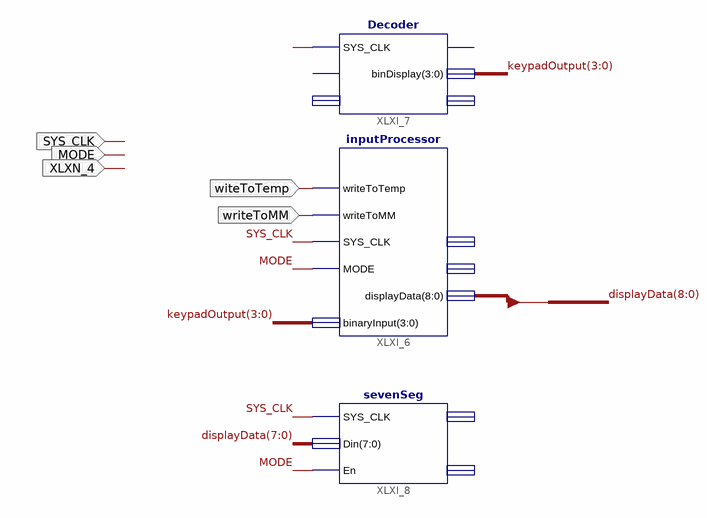
[diagram p0: schematic sheet 1]
// Xilinx ISE schematic RyanSandbox.sch (spartan3e) as structural Verilog: 3 symbols, 5 ports
module RyanSandbox (
  input  SYS_CLK,
  input  MODE,
  input  XLXN_4,
  input  writeToMM,
  input  witeToTemp
);

  wire XLXN_2;
  wire [3:0] keypadOutput;
  wire [8:0] displayData;

  inputProcessor XLXI_6 (
    .SYS_CLK(SYS_CLK), .writeToTemp(witeToTemp), .binaryInput(keypadOutput), .writeToMM(writeToMM),
    .MODE(MODE), .displayData(displayData));  // open: opCode, immediate
  Decoder XLXI_7 (.SYS_CLK(XLXN_2), .binDisplay(keypadOutput));  // open: En, row, colO, keyO
  sevenSeg XLXI_8 (.SYS_CLK(SYS_CLK), .Din(displayData[7:0]), .En(MODE));  // open: sseg, anO
endmodule
